# Altium schematic sheet USB3.SchDoc
size A3; SheetNumber: 16; SheetTotal: 21
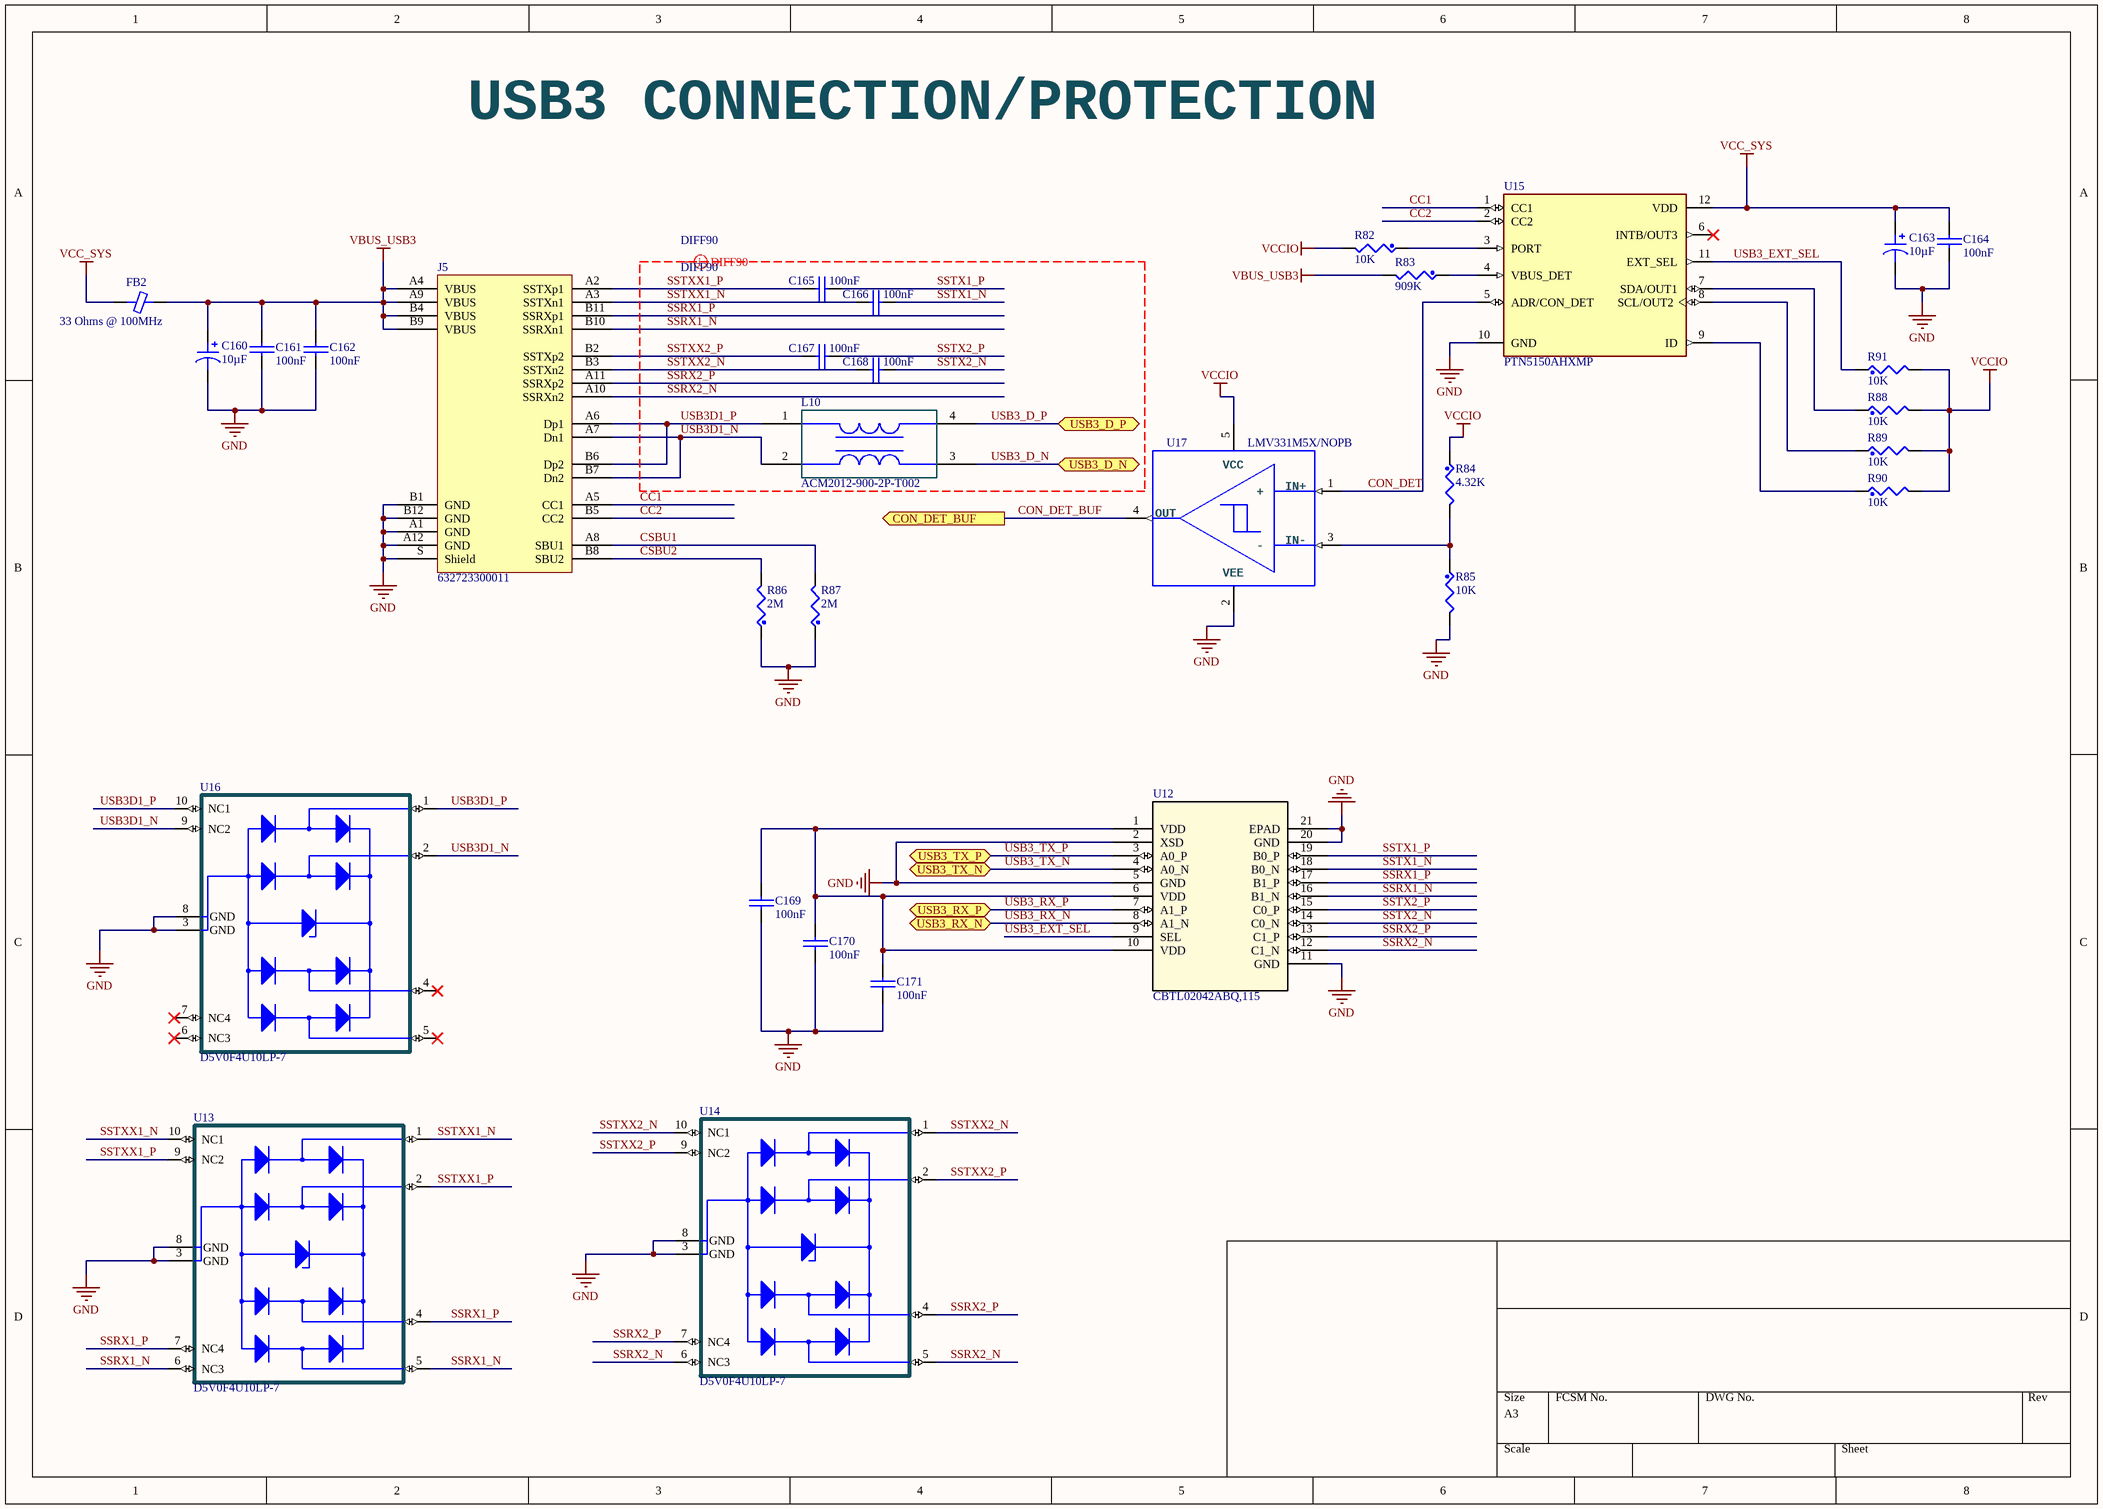
[diagram p0: USB3.SchDoc]

## Parts
C160  10µF  [CAP POL 1206_3216]
C161  100nF  [0402_CC - C]
C162  100nF  [0402_CC - C]
C163  10µF  [CAP POL 1206_3216]
C164  100nF  [0402_CC - C]
C165  100nF  [0402_CC - C]
C166  100nF  [0402_CC - C]
C167  100nF  [0402_CC - C]
C168  100nF  [0402_CC - C]
C169  100nF  [0402_CC - C]
C170  100nF  [0402_CC - C]
C171  100nF  [0402_CC - C]
FB2  33 Ohms @ 100MHz  [FER 0805_2012]
J5  632723300011  [WURTH 632723300011]
L10  ACM2012-900-2P-T002  [FP-ACM2012-MFG]
R82  10K  [0402_CR]
R83  909K  [0402_CR]
R84  4.32K  [0402_CR]
R85  10K  [0402_CR]
R86  2M  [0402_CR]
R87  2M  [0402_CR]
R88  10K  [0402_CR]
R89  10K  [0402_CR]
R90  10K  [0402_CR]
R91  10K  [0402_CR]
U12  CBTL02042ABQ,115  [DHVQFN20_SOT764-1_NXP-L]
U13  D5V0F4U10LP-7  [TI_TPD4E05U06DQAR]
U14  D5V0F4U10LP-7  [TI_TPD4E05U06DQAR]
U15  PTN5150AHXMP  [USBCONTROLLER_PTN5150AHXMP]
U16  D5V0F4U10LP-7  [TI_TPD4E05U06DQAR]
U17  LMV331M5X/NOPB  [MF05A]

## Ports
CON_DET_BUF (out), USB3_D_N (bidir), USB3_D_P (bidir), USB3_RX_N (bidir), USB3_RX_P (bidir), USB3_TX_N (bidir), USB3_TX_P (bidir)

## Nets
GND: C160.2 C161.2 C162.2 C163.2 C164.2 C169.2 C170.2 C171.2 J5.A1(GND) J5.A12(GND) J5.B1(GND) J5.B12(GND) J5.S(Shield) R85.2 R86.1 R87.1 U12.2(XSD) U12.5(GND) U12.11(GND) U12.20(GND) U12.21(EPAD) U13.3(GND) U13.8(GND) U14.3(GND) U14.8(GND) U15.10(GND) U16.3(GND) U16.8(GND) U17.2(V-)
VBUS_USB3: C160.1 C161.1 C162.1 FB2.2 J5.A4(VBUS) J5.A9(VBUS) J5.B4(VBUS) J5.B9(VBUS) R83.2
VCC_SYS: C163.1 C164.1 FB2.1 U15.12(VDD)
VCCIO: R82.2 R84.1 R88.2 R89.2 R90.2 R91.2 U17.5(V+)
CC1: J5.A5(CC1) U15.1(CC1)
CC2: J5.B5(CC2) U15.2(CC2)
CON_DET: U15.5(ADR/CON_DET) U17.1(IN+)
CON_DET_BUF: U17.4(OUT) ; port CON_DET_BUF
CSBU1: J5.A8(SBU1) R87.2
CSBU2: J5.B8(SBU2) R86.2
SSRX1_N: J5.B10(SSRXn1) U12.16(B1_N) U13.5(D2-) U13.6(NC3)
SSRX1_P: J5.B11(SSRXp1) U12.17(B1_P) U13.4(D2+) U13.7(NC4)
SSRX2_N: J5.A10(SSRXn2) U12.12(C1_N) U14.5(D2-) U14.6(NC3)
SSRX2_P: J5.A11(SSRXp2) U12.13(C1_P) U14.4(D2+) U14.7(NC4)
SSTX1_N: C166.2 U12.18(B0_N)
SSTX1_P: C165.2 U12.19(B0_P)
SSTX2_N: C168.2 U12.14(C0_N)
SSTX2_P: C167.2 U12.15(C0_P)
SSTXX1_N: C166.1 J5.A3(SSTXn1) U13.1(D1+) U13.10(NC1)
SSTXX1_P: C165.1 J5.A2(SSTXp1) U13.2(D1-) U13.9(NC2)
SSTXX2_N: C168.1 J5.B3(SSTXn2) U14.1(D1+) U14.10(NC1)
SSTXX2_P: C167.1 J5.B2(SSTXp2) U14.2(D1-) U14.9(NC2)
USB3_D_N: L10.3 ; port USB3_D_N
USB3_D_P: L10.4 ; port USB3_D_P
USB3_EXT_SEL: R91.1 U12.9(SEL) U15.11(EXT_SEL)
USB3_RX_N: U12.8(A1_N) ; port USB3_RX_N
USB3_RX_P: U12.7(A1_P) ; port USB3_RX_P
USB3_TX_N: U12.4(A0_N) ; port USB3_TX_N
USB3_TX_P: U12.3(A0_P) ; port USB3_TX_P
USB3D1_N: J5.A7(Dn1) J5.B7(Dn2) L10.2 U16.2(D1-) U16.9(NC2)
USB3D1_P: J5.A6(Dp1) J5.B6(Dp2) L10.1 U16.1(D1+) U16.10(NC1)
NetC169_1: C169.1 C170.1 C171.1 U12.1(VDD) U12.6(VDD) U12.10(VDD)
NetR82_1: R82.1 U15.3(PORT)
NetR83_1: R83.1 U15.4(VBUS_DET)
NetR84_2: R84.2 R85.1 U17.3(IN-)
NetR88_1: R88.1 U15.7(SDA/OUT1)
NetR89_1: R89.1 U15.8(SCL/OUT2)
NetR90_1: R90.1 U15.9(ID)

Not connected (* = marked no-connect by the designer): U15 6(INTB/OUT3)*; U16 4(D2+)* 5(D2-)* 6(NC3)* 7(NC4)*

## Layout directives
differential pair; differential pair class DIFF90; net class DIFF90: SSRX1_N, SSRX1_P, SSRX2_N, SSRX2_P, SSTX1_N, SSTX1_P, SSTX2_N, SSTX2_P, SSTXX1_N, SSTXX1_P, SSTXX2_N, SSTXX2_P, USB3_D_N, USB3_D_P, USB3D1_N, USB3D1_P

## Notes on the sheet
- USB3 CONNECTION/PROTECTION
- (in symbol LMV331M5X/NOPB) VCC; +; -; VEE

## Library data of the parts
C160 C163 = ATCC-211A-010-106M-T: CAP TANT 10UF 20% 10V 1206; manufacturer: Abracon LLC; Manufacturer Size Code: A; ESR (Equivalent Series Resistance): 4Ohm; Type: Molded; Part Number: ATCC-211A-010-106M-T; Value: 10µF; Capacitance: 10µF; componentlink1description: Datasheet; componentlink1url: https://abracon.com/Magnetics/inductors/ATCC-211.pdf; componentlink2description: DigiKey Link; componentlink2url: http://digikey.com/product-detail/en/abracon-llc/ATCC-211A-010-106M-T/ATCC-211A-010-106M-TCT-ND/4843468; Device Package: 1206 (3216 Metric); Features: General Purpose; Height - Seated (Max): 0.071" (1.80mm); lastupdated: 9/2/2020 1:15:55 AM; Lifecycle Status: Active; Minimum Order: 1; Mounting Type: Surface Mount; Operating Temperature: -55°C ~ 125°C; Package / Case: 1206 (3216 Metric); packaging: TapeAndReel; partid: 1668; Part Status: Active; price: 0.46; series: ATCC-211; Size / Dimension: 0.126" L x 0.063" W (3.20mm x 1.60mm); Supplier 1: DigiKey; Supplier Part Number 1: ATCC-211A-010-106M-TCT-ND; Tolerance: ±20%; Voltage - Rated: 10V
C161 C162 C164-C171 = CAP_NP: CLASS: DISCRETE
FB2 = Z0805C330ASMST: FERRITE BEAD 33 OHM 0805 1LN; Manufacturer: KEMET; Current Rating (Max): 1.2A; DC Resistance (DCR) (Max): 50mOhm; Filter Type: Signal Line; Number of Lines: 1; Part Number: Z0805C330ASMST; ComponentLink1Description: Datasheet; ComponentLink1URL: https://content.kemet.com/datasheets/F3115.pdf; ComponentLink2Description: DigiKey Link; ComponentLink2URL: http://digikey.com/product-detail/en/kemet/Z0805C330ASMST/399-9619-1-ND/3674058; Device Package: 0805 (2012 Metric); Height (Max): 0.041" (1.05mm); Impedance @ Frequency: 33 Ohms @ 100MHz; LastUpdated: 3/24/2022 2:23:39 PM; Lifecycle Status: Active; Minimum Order: 1; Mounting Type: Surface Mount; Operating Temperature: -55°C ~ 125°C; Package / Case: 0805 (2012 Metric); Packaging: TapeAndReel; PartId: 1206; Part Status: Active; Price: 0.04; Series: Z-SMS; Size / Dimension: 0.079" L x 0.049" W (2.00mm x 1.25mm); Supplier 1: DigiKey; Supplier Part Number 1: 399-9619-1-ND; Value: 33 Ohms @ 100MHz
J5 = 632723300011: CONN RCP USB3.1 TYPEC 24P SMD RA; Manufacturer: Würth Elektronik; Connector Type: USB - C (Type - C); Current Rating (Amps): 5A; Gender: Receptacle; Mating Cycles: 10000; Number of Contacts: 24; Number of Ports: 1; Shielding: Unshielded; Specifications: USB 3.1 (USB 3.1 Gen 2, Superspeed+); Voltage - Rated: 20VDC; Part Number: 632723300011; ComponentLink1Description: Datasheet; ComponentLink1URL: https://katalog.we-online.de/em/datasheet/632723x00011.pdf; ComponentLink2Description: DigiKey Link; ComponentLink2URL: http://digikey.com/product-detail/en/w-rth-elektronik/632723300011/732-9618-1-ND/5806673; LastUpdated: 5/24/2020 10:36:40 PM; Lifecycle Status: Active; Minimum Order: 1; Mounting Feature: Horizontal; Mounting Type: Surface Mount, Right Angle; Through Hole; Operating Temperature: -40°C ~ 105°C; Packaging: TapeAndReel; Part Status: Active; Price: 2.95; Series: WR-COM; Supplier 1: DigiKey; Supplier Part Number 1: 732-9618-1-ND; Termination: Solder
L10 = ACM2012-900-2P-T002: CMC 400MA 2LN 90 OHM SMD; Mfr_Name: TDK; Type: DEV; Copyright: Copyright (C) 2022 Ultra Librarian. All rights reserved.; Manufacturer_Part_Number: ACM2012-900-2P-T002; Digi-Key_Part_Number_1: 445-2207-2-ND; Digi-Key_Part_Number_2: 445-2207-1-ND; Digi-Key_Part_Number_3: 445-2207-6-ND; Digi-Key_Part_Number_4: 445-2207-2-NDL; RefDes: RefDes
R82-R91 = RES: CLASS: DISCRETE
U12 = CBTL02042ABQ,115: IC MUX/DEMUX 2:1 PCI 20DHVQFN; Mfr_Name: NXP; Copyright: Copyright (C) 2022 Ultra Librarian. All rights reserved.; Manufacturer_Part_Number: CBTL02042ABQ,115; Digi-Key_Part_Number_1: 568-6676-2-ND; Digi-Key_Part_Number_2: 568-6676-1-ND; Digi-Key_Part_Number_3: 568-6676-6-ND; RefDes: RefDes; Type: DEV
U13 U14 U16 = D5V0F4U10LP-7: TVS DIODE 5.5VWM 12VC U-DFN2510; Mfr: Diodes Incorporated; Price: None; Availability: Available; Value: *; Package: UFDFN-10 Texas Instruments; Mfr_Part_No: D5V0F4U10LP-7; Creator: AAR
U15 = PTN5150AHXMP: USB Controller USB Interface 12-X2QFN (1.6x1.6); Mfr: NXP USA; Value: *; Check_prices: https://www.snapeda.com/parts/PTN5150AHXMP/NXP%20USA%20Inc./view-part/925094/?ref=eda; Mfr_Part_Number: PTN5150AHXMP; Price: None; Package: XFQFN-12 NXP Semiconductors; Availability: Good
U17 = LMV331M5X/NOPB: IC COMPARATOR TINY LV SOT23-5; Mfr_Name: Texas Instruments; Manufacturer: NationalSemiconductor; Characteristics: LMV331M5SingleGeneralPurposeLowVoltageSingleComparator; CompType: ComparatorIC; TaMin_C: -400; TaMax_C: 850; ComponentLink1DescBC: LMV331Datasheet; ComponentLink2DescA4: LMV331WebPage; ComponentLink3DescAC: MF05APackageWebPage; Copyright: Copyright (C) 2022 Ultra Librarian. All rights reserved.; Manufacturer_Part_Number: LMV331M5X/NOPB; Digi-Key_Part_Number_1: 2156-LMV331M5X/NOPB-ND; Digi-Key_Part_Number_2: 2156-LMV331M5X/NOPB-TI-ND; Digi-Key_Part_Number_3: LMV331M5X/NOPBCT-ND; Digi-Key_Part_Number_4: LMV331M5X/NOPBDKR-ND; Digi-Key_Part_Number_5: LMV331M5X/NOPBTR-ND; RefDes: RefDes; Type: DEV; SymbolVersion: 2008-07-09; PartNumber: LMV331M5; PackageDescription: 5LeadSOT-23; PackageReference: MF05A_L; RoHS: O; ComponentLink1URL: http//wwwnationalcom/ds/LM/LMV331pdf; ComponentLink2URL: http//wwwnationalcom/pf/LM/LMV331html; ComponentLink3URL: http//wwwnationalcom/packaging/folders/mf05ahtml; Version: B1608; LatestRevisionDate: 2009-03-16; LatestRevisionNote: MassUpdate; Publisher: NationalSemiconductor; Published: 2009-03-16